# Altium schematic sheet GSM_INTERFACE.SchDoc
size A4; SheetNumber: 16; SheetTotal: 27
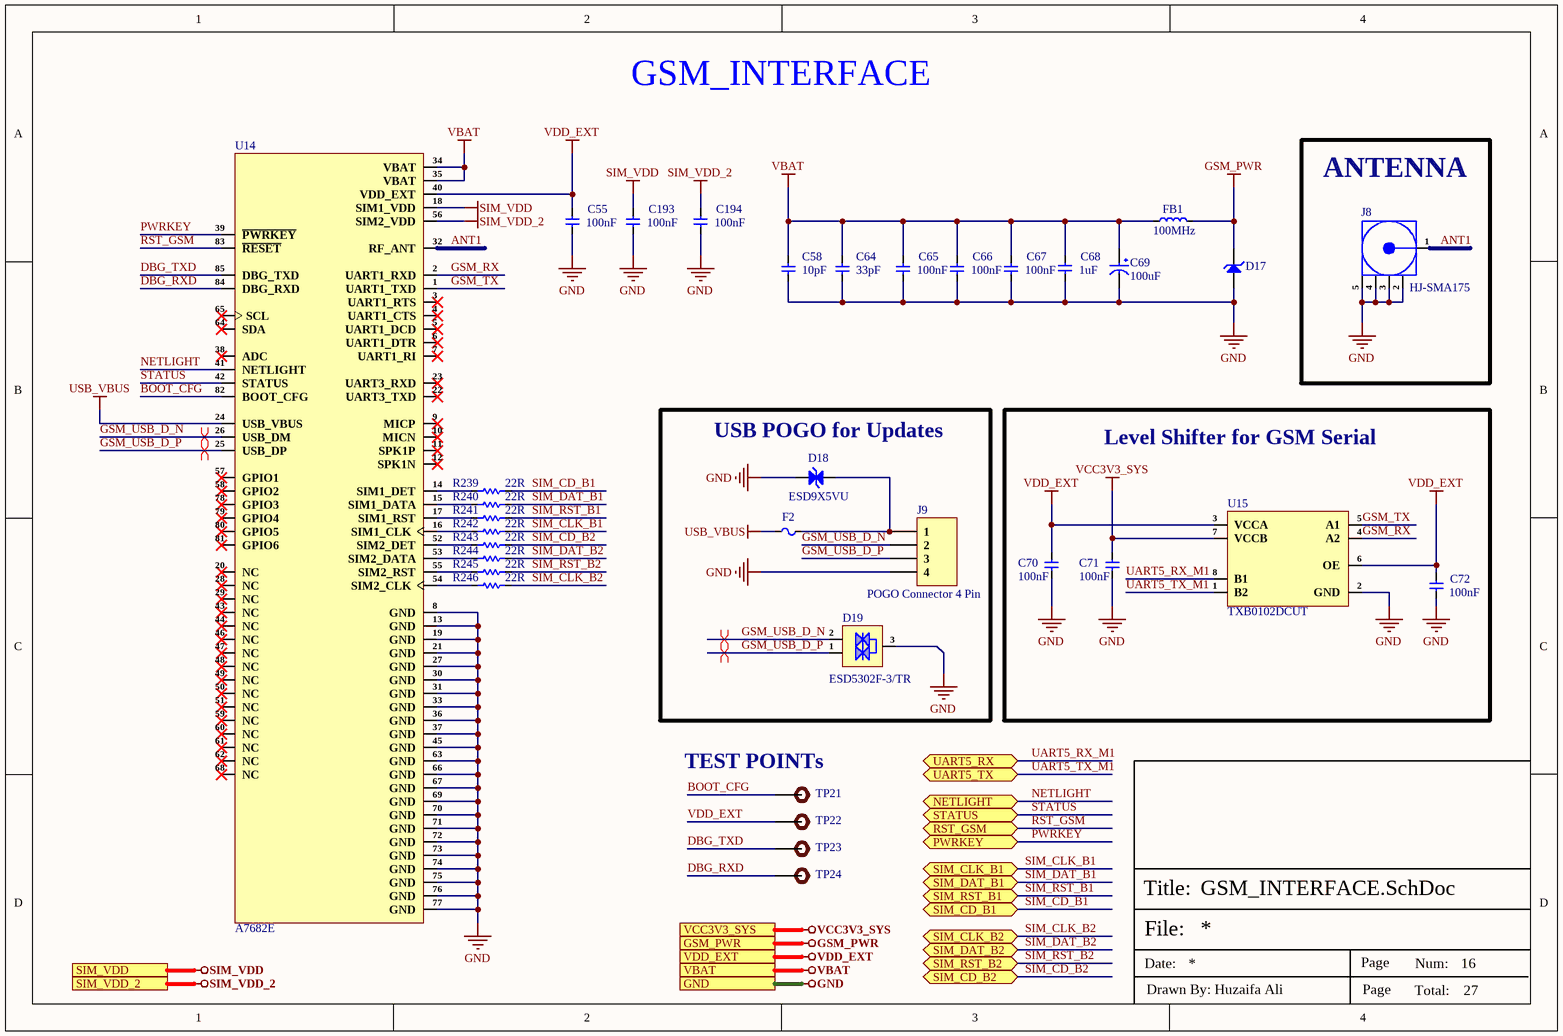
[diagram p0: GSM_INTERFACE.SchDoc]

## Parts
C55  100nF  [Cap-0402]
C58  10pF  [Cap-0402]
C64  33pF  [Cap-0402]
C65  100nF  [Cap-0402]
C66  100nF  [Cap-0402]
C67  100nF  [Cap-0402]
C68  1uF  [Cap-0402]
C69  100uF  [Case-B]
C70  100nF  [Cap-0402]
C71  100nF  [Cap-0402]
C72  100nF  [Cap-0402]
C193  100nF  [Cap-0402]
C194  100nF  [Cap-0402]
D17  MMSZ5231BT1G  [SOD-123]  (value not drawn)
D18  ESD9X5VU  [DFN1006-2L_]
D19  ESD5302F-3/TR  [Sot-23]
F2  SMD0603-050  [Fuse-0603]  (value not drawn)
FB1  100MHz  [Ind-0805]
J8  HJ-SMA175  [HJ-SMA175]
J9  POGO Connector 4 Pin  [Pogo 4 Pin]
R239  22R  [Res-0402]
R240  22R  [Res-0402]
R241  22R  [Res-0402]
R242  22R  [Res-0402]
R243  22R  [Res-0402]
R244  22R  [Res-0402]
R245  22R  [Res-0402]
R246  22R  [Res-0402]
TP21  TEST POINT 0.5mm Dia  [Test-point - 0.5mm]  (value not drawn)  (no BOM)
TP22  TEST POINT 0.5mm Dia  [Test-point - 0.5mm]  (value not drawn)  (no BOM)
TP23  TEST POINT 0.5mm Dia  [Test-point - 0.5mm]  (value not drawn)  (no BOM)
TP24  TEST POINT 0.5mm Dia  [Test-point - 0.5mm]  (value not drawn)  (no BOM)
U14  A7682E  [A7682E]
U15  TXB0102DCUT  [TXB0102DCUT]

## Blocks framed on the sheet
ANTENNA: J8
USB POGO for Updates: D18 D19 F2 J9
Level Shifter for GSM Serial: C70-C72 U15

## Ports
GND (see TOP SHEET[4B], AUDIO_INTERFACE[1D], BUCK REGULATOR[3D], DEBUG_UART_INTERFACE[3D], DIGITAL IO_RELAY_SHEET[5D], DUAL_SIM_INTERFACE[3D], ETHERNET_PHY0[4D], ETHERNET_PHY1[4D], HDMI_INTERFACE[3D], INPUT_PROTECTION[3D], LINEAR_VOLTAGE_REG[3D], MICRO_SD_INTERFACE[3D], MIPI-DSI DISPLAY[3D], POWER SECTION[3D], PUSH BUTTONs_INTERFACE[3C], RGB_LEDs_INTERFACE[3D], ROCKCHIP_PWR_SUPPLY[1D], ROCKCHIP_SYSTEM_CONTROL[3C], RS232_RS485_INTERFACE[3C], SENSOR_SHEET[3D], USB2.0_INTERFACE[3D], USB3.0_INTERFACE[3D], USB-C_INTERFACE[2D], WIEGAND_INTERFACE[3D], WIFI_BLUETOOTH_SHEET[4C]), GSM_PWR (see TOP SHEET[4A], LINEAR_VOLTAGE_REG[3D], POWER SECTION[3D]), NETLIGHT (bidir, see TOP SHEET[5B], DUAL_SIM_INTERFACE[2D]), PWRKEY (bidir, see TOP SHEET[5B], DUAL_SIM_INTERFACE[2D]), RST_GSM (bidir, see TOP SHEET[5B], DUAL_SIM_INTERFACE[2D]), SIM_CD_B1 (bidir, see TOP SHEET[5A], DUAL_SIM_INTERFACE[3D]), SIM_CD_B2 (bidir, see TOP SHEET[5A], DUAL_SIM_INTERFACE[3D]), SIM_CLK_B1 (bidir, see TOP SHEET[5A], DUAL_SIM_INTERFACE[3D]), SIM_CLK_B2 (bidir, see TOP SHEET[5A], DUAL_SIM_INTERFACE[3D]), SIM_DAT_B1 (bidir, see TOP SHEET[5A], DUAL_SIM_INTERFACE[3D]), SIM_DAT_B2 (bidir, see TOP SHEET[5A], DUAL_SIM_INTERFACE[3D]), SIM_RST_B1 (bidir, see TOP SHEET[5A], DUAL_SIM_INTERFACE[3D]), SIM_RST_B2 (bidir, see TOP SHEET[5A], DUAL_SIM_INTERFACE[3D]), SIM_VDD (see TOP SHEET[5A], DUAL_SIM_INTERFACE[3D]), SIM_VDD_2 (see TOP SHEET[5A], DUAL_SIM_INTERFACE[3D]), STATUS (bidir, see TOP SHEET[5B], DUAL_SIM_INTERFACE[2D]), UART5_RX (bidir, see TOP SHEET[5B], DEBUG_UART_INTERFACE[3D]), UART5_TX (bidir, see TOP SHEET[5B], DEBUG_UART_INTERFACE[3D]), VBAT (see TOP SHEET[5B], DUAL_SIM_INTERFACE[3D]), VCC3V3_SYS (see TOP SHEET[4A], AUDIO_INTERFACE[1D], BUCK REGULATOR[3D], DEBUG_UART_INTERFACE[3D], DIGITAL IO_RELAY_SHEET[5D], ETHERNET_PHY0[4D], ETHERNET_PHY1[4D], HDMI_INTERFACE[3D], LINEAR_VOLTAGE_REG[3D], MIPI-DSI DISPLAY[3D], POWER SECTION[3D], PUSH BUTTONs_INTERFACE[3C], ROCKCHIP_PWR_SUPPLY[1D], ROCKCHIP_SYSTEM_CONTROL[3C], RS232_RS485_INTERFACE[3C], SENSOR_SHEET[3D], USB-C_INTERFACE[2D], WIEGAND_INTERFACE[3D], WIFI_BLUETOOTH_SHEET[4C]), VDD_EXT (see TOP SHEET[5B], DUAL_SIM_INTERFACE[3D])

## Nets
GND: C55.1 C58.1 C64.1 C65.1 C66.1 C67.1 C68.2 C69.2 C70.2 C71.2 C72.1 C193.1 C194.1 D17.1(A) D18.1(A) D19.3(GND) J8.2(GND) J8.3(GND) J8.4(GND) J8.5(GND) J9.4 U14.8(GND) U14.13(GND) U14.19(GND) U14.21(GND) U14.27(GND) U14.30(GND) U14.31(GND) U14.33(GND) U14.36(GND) U14.37(GND) U14.45(GND) U14.63(GND) U14.66(GND) U14.67(GND) U14.69(GND) U14.70(GND) U14.71(GND) U14.72(GND) U14.73(GND) U14.74(GND) U14.75(GND) U14.76(GND) U14.77(GND) U15.2(GND) ; port GND
GSM_PWR: D17.2(K) FB1.2 ; port GSM_PWR
SIM_VDD: C193.2 U14.18(SIM1_VDD) ; port SIM_VDD
SIM_VDD_2: C194.2 U14.56(SIM2_VDD) ; port SIM_VDD_2
USB_VBUS: F2.1 U14.24(USB_VBUS)
VBAT: C58.2 C64.2 C65.2 C66.2 C67.2 C68.1 C69.1 FB1.1 U14.34(VBAT) U14.35(VBAT) ; port VBAT
VCC3V3_SYS: C71.1 U15.7(VCCB) ; port VCC3V3_SYS
VDD_EXT: C55.2 C70.1 C72.2 TP22.1 U14.40(VDD_EXT) U15.3(VCCA) U15.6(OE) ; port VDD_EXT
ANT1: J8.1(Signal) U14.32(RF_ANT)
BOOT_CFG: TP21.1 U14.82(BOOT_CFG)
DBG_RXD: TP24.1 U14.84(DBG_RXD)
DBG_TXD: TP23.1 U14.85(DBG_TXD)
GSM_RX: U14.2(UART1_RXD) U15.4(A2)
GSM_TX: U14.1(UART1_TXD) U15.5(A1)
GSM_USB_D_N: D19.2(I/O2) J9.2 U14.26(USB_DM)
GSM_USB_D_P: D19.1(I/O1) J9.3 U14.25(USB_DP)
NETLIGHT: U14.41(NETLIGHT) ; port NETLIGHT
PWRKEY: U14.39(~{PWRKEY}) ; port PWRKEY
RST_GSM: U14.83(~{RESET}) ; port RST_GSM
SIM_CD_B1: R239.2 ; port SIM_CD_B1
SIM_CD_B2: R243.2 ; port SIM_CD_B2
SIM_CLK_B1: R242.2 ; port SIM_CLK_B1
SIM_CLK_B2: R246.2 ; port SIM_CLK_B2
SIM_DAT_B1: R240.2 ; port SIM_DAT_B1
SIM_DAT_B2: R244.2 ; port SIM_DAT_B2
SIM_RST_B1: R241.2 ; port SIM_RST_B1
SIM_RST_B2: R245.2 ; port SIM_RST_B2
STATUS: U14.42(STATUS) ; port STATUS
UART5_RX_M1: U15.8(B1) ; port UART5_RX
UART5_TX_M1: U15.1(B2) ; port UART5_TX
NetD18_2: D18.2(A) F2.2 J9.1
NetR239_1: R239.1 U14.14(SIM1_DET)
NetR240_1: R240.1 U14.15(SIM1_DATA)
NetR241_1: R241.1 U14.17(SIM1_RST)
NetR242_1: R242.1 U14.16(SIM1_CLK)
NetR243_1: R243.1 U14.52(SIM2_DET)
NetR244_1: R244.1 U14.53(SIM2_DATA)
NetR245_1: R245.1 U14.55(SIM2_RST)
NetR246_1: R246.1 U14.54(SIM2_CLK)

Not connected (* = marked no-connect by the designer): U14 3(UART1_RTS)* 4(UART1_CTS)* 5(UART1_DCD)* 6(UART1_DTR)* 7(UART1_RI)* 9(MICP)* 10(MICN)* 11(SPK1P)* 12(SPK1N)* 20(NC)* 22(UART3_TXD)* 23(UART3_RXD)* 28(NC)* 29(NC)* 38(ADC)* 43(NC)* 44(NC)* 46(NC)* 47(NC)* 48(NC)* 49(NC)* 50(NC)* 51(NC)* 57(GPIO1)* 58(GPIO2)* 59(NC)* 60(NC)* 61(NC)* 62(NC)* 64(SDA)* 65(SCL)* 68(NC)* 78(GPIO3)* 79(GPIO4)* 80(GPIO5)* 81(GPIO6)*

## Layout directives
differential pair; net class GSM_USB; differential pair class GSM_USB_Lines; rule Impedance Constraint [Min = 88.00    Max = 90.00    ]; rule Matched Net Lengths [Tolerance = 20mil]: GSM_USB_D_N, GSM_USB_D_P

## Notes on the sheet
- GSM_INTERFACE
- (near TP21) TEST POINTs
- File:
- Title:
- Date:
- Page
- Num:
- Total:
- Drawn By: Huzaifa Ali

## Library data of the parts
C55 C65-C67 C70-C72 C193 C194 = CC0402KRX5R7BB104: CAP CER 0.1UF 16V X5R 0402; Manufacturer: Yageo; Tolerance: 10%; Supplier 1: Mouser; Manufacturer Part Number: CC0402KRX5R7BB104; RoHS: Yes; Category: Ceramic Capacitors; Stock 1: 936792; Pricing 1: 1=0.10000, 10=0.02300, 50=0.02300, 100=0.01100, 1000=0.00600, 10000=0.00400 (USD); Mount: Surface Mount; Case/Package: 0402; Case Code (Imperial): 0402; Case Code (Metric): 1005; Min Operating Temperature: -55°C; Max Operating Temperature: 85°C; Capacitance: 100nF; Packaging: Tape and Reel; Voltage Rating: 16V; Dielectric: X5R; Termination: SMD/SMT; Voltage Rating (DC): 16V; Package Quantity: 1; Length: 1mm; Width: 0.02inch; Thickness: 0.022inch; Lead Free: Lead Free; Halogen Free: Halogen Free; ComponentLink1URL: https://datasheet.ciiva.com/155/mlccorderingcode-155879.pdf?src-supplier=Digi-Key; ComponentLink1Description: https://datasheet.ciiva.com/155/mlccorderingcode-155879.pdf?src-supplier=Digi-Key; ComponentLink2URL: https://datasheet.ciiva.com/155/mlccorderingcode-155878.pdf?src-supplier=Digi-Key; ComponentLink2Description: https://datasheet.ciiva.com/155/mlccorderingcode-155878.pdf?src-supplier=Digi-Key; ComponentLink3URL: https://datasheet.ciiva.com/155/mlccorderingcode-155880.pdf?src-supplier=Digi-Key; ComponentLink3Description: https://datasheet.ciiva.com/155/mlccorderingcode-155880.pdf?src-supplier=Digi-Key; Supplier Part Number 1: 603-CC402KRX5R7BB104; LCSC Part Number: C106204; Number of Pins: 2; Resistor Type: Ceramic; Series: CC; Construction: Flat; Height: 0.5mm; Depth: 0.5mm; Radiation Hardening: No; REACH SVHC: Unknown; RoHS Compliant: Yes; ComponentLink4URL: https://datasheet.ciiva.com/11464/upy-gphc-x5r-4v-to-50v-12-11464869.pdf?src-supplier=Avnet; ComponentLink4Description: https://datasheet.ciiva.com/11464/upy-gphc-x5r-4v-to-50v-12-11464869.pdf?src-supplier=Avnet
C58 = GRM1555C1H100JA01D: CAP CER 10PF 50V C0G/NP0 0402; Manufacturer: Murata; Material: Ceramic; Dielectric: C0G; Tolerance: 5%; Item Type: Capacitor; Supplier: Arrow Electronics; Supplier Part Number: GRM1555C1H100JA01D; Manufacturer Part Number: GRM1555C1H100JA01D; RoHS: Yes; Category: Ceramic Capacitors; Stock: 3860000; Pricing: 10000=0.0034, 50000=0.0027, 100000=0.0023, 250000=0.0021 (USD); Mounting Technology: Surface Mount; Case/Package: 0402; Case Code (Metric): 1005; Case Code (Imperial): 0402; Min Operating Temperature: -55°C; Max Operating Temperature: 125°C; Value: 10pF; Voltage Rating: 50V; Packaging: Tape and Reel; Package Quantity: 1; Voltage Rating (DC): 50V; Termination: SMD/SMT; Series: GRM; Voltage: 50V; Construction: Flat; Length: 1mm; Width: 0.02inch; Height: 0.5mm; Depth: 0.5mm; Thickness: 0.022inch; Radiation Hardening: No; RoHS Compliant: Yes; Lead Free: Lead Free; Reach SVHC Compliant: No; ComponentLink1URL: https://datasheet.ciiva.com/2989/product-2989280.pdf?src-supplier=Avnet; ComponentLink1Description: https://datasheet.ciiva.com/2989/product-2989280.pdf?src-supplier=Avnet; ComponentLink2URL: https://datasheet.ciiva.com/18184/getdatasheetpartid-307234-18184164.pdf?src-supplier=Verical; ComponentLink2Description: https://datasheet.ciiva.com/18184/getdatasheetpartid-307234-18184164.pdf?src-supplier=Verical; ComponentLink3URL: https://datasheet.ciiva.com/29200/453545-da-01-en-vs-kondensator-0402-29200107.pdf?src-supplier=Conrad; ComponentLink3Description: https://datasheet.ciiva.com/29200/453545-da-01-en-vs-kondensator-0402-29200107.pdf?src-supplier=Conrad; ComponentLink4URL: https://datasheet.ciiva.com/7828/1666664-7828812.pdf?src-supplier=Element14; ComponentLink4Description: https://datasheet.ciiva.com/7828/1666664-7828812.pdf?src-supplier=Element14; ComponentLink5URL: https://datasheet.ciiva.com/6271/partnumbering-e-01-6271159.pdf?src-supplier=Digi-Key; ComponentLink5Description: https://datasheet.ciiva.com/6271/partnumbering-e-01-6271159.pdf?src-supplier=Digi-Key; ComponentLink6URL: https://datasheet.ciiva.com/6271/partnumbering-e-01-6271158.pdf?src-supplier=Digi-Key; ComponentLink6Description: https://datasheet.ciiva.com/6271/partnumbering-e-01-6271158.pdf?src-supplier=Digi-Key; ComponentLink7URL: https://datasheet.ciiva.com/6271/partnumbering-e-01-6271068.pdf?src-supplier=Digi-Key; ComponentLink7Description: https://datasheet.ciiva.com/6271/partnumbering-e-01-6271068.pdf?src-supplier=Digi-Key; LCSC Part Number: C76946
C64 = GRM1555C1E330JA01D: CAP CER 33PF 25V C0G/NP0 0402; Manufacturer: Murata; Tolerance: 5%; Dielectric: C0G; Item Type: Capacitor; Supplier 1: Digi-Key; Manufacturer Part Number: GRM1555C1E330JA01D; Stock 1: 250773; Pricing 1: 1=0.1, 10=0.034, 50=0.0184, 100=0.0151, 500=0.01078, 1000=0.00847, 2500=0.0077, 5000=0.00708 (USD); Mount: Surface Mount; Case/Package: 0402; Case Code (Metric): 1005; Case Code (Imperial): 0402; Min Operating Temperature: -55°C; Max Operating Temperature: 125°C; Capacitance: 33pF; Package Quantity: 1; Voltage Rating: 25V; Packaging: Tape and Reel; Voltage Rating (DC): 25V; Termination: SMD/SMT; Voltage: 25V; Series: GRM; Construction: Flat; Length: 1mm; Width: 0.02inch; Height: 0.5mm; Thickness: 0.022inch; Depth: 0.5mm; Radiation Hardening: No; Lead Free: Lead Free; RoHS Compliant: Yes; ComponentLink1URL: https://www.murata.com/~/media/webrenewal/support/library/catalog/products/capacitor/mlcc/c02e.ashx?la=en-us&src-supplier=Digi-Key; ComponentLink1Description: https://www.murata.com/~/media/webrenewal/support/library/catalog/products/capacitor/mlcc/c02e.ashx?la=en-us&src-supplier=Digi-Key; ComponentLink2URL: http://www.mouser.com/ds/2/281/c02e-2905.pdf?src-supplier=Mouser; ComponentLink2Description: http://www.mouser.com/ds/2/281/c02e-2905.pdf?src-supplier=Mouser; ComponentLink3URL: http://psearch.murata.com/capacitor/product/GRM1555C1E330JA01%23.pdf?src-supplier=Avnet; ComponentLink3Description: http://psearch.murata.com/capacitor/product/GRM1555C1E330JA01%23.pdf?src-supplier=Avnet; Supplier Part Number 1: 490-6177-1-ND; LCSC Part Number: C441758
C68 = CC0402KRX5R8BB105: CAP CER 1UF 25V X5R 0402; Manufacturer: Yageo; Tolerance: 10%; Supplier 1: Mouser; Manufacturer Part Number: CC0402KRX5R8BB105; RoHS: Yes; Category: Ceramic Capacitors; Stock 1: 91975; Pricing 1: 1=0.30000, 10=0.20400, 50=0.20400, 100=0.11600, 1000=0.07200, 10000=0.05900 (USD); Mount: Surface Mount; Case/Package: 0402; Case Code (Metric): 1005; Case Code (Imperial): 0402; Min Operating Temperature: -55°C; Max Operating Temperature: 85°C; Capacitance: 1uF; Dielectric: X5R; Package Quantity: 10000; Voltage Rating: 25V; Packaging: Tape and Reel; Termination: SMD/SMT; Voltage Rating (DC): 25V; Length: 0.039inch; Width: 0.02inch; Thickness: 0.022inch; Lead Free: Lead Free; Halogen Free: Halogen Free; RoHS Compliant: Yes; ComponentLink1URL: http://www.mouser.com/ds/2/447/Yageo_UPY-GP_NP0_16V-to-50V_9-358835.pdf?src-supplier=Mouser; ComponentLink1Description: http://www.mouser.com/ds/2/447/Yageo_UPY-GP_NP0_16V-to-50V_9-358835.pdf?src-supplier=Mouser; ComponentLink2URL: http://www.yageo.com/documents/recent/UPY-GPHC_X5R_4V-to-50V_25.pdf?src-supplier=Digi-Key; ComponentLink2Description: http://www.yageo.com/documents/recent/UPY-GPHC_X5R_4V-to-50V_25.pdf?src-supplier=Digi-Key; ComponentLink3URL: https://4donline.ihs.com/images/VipMasterIC/IC/YAGO/YAGO-S-A0006851646/YAGO-S-A0006851646-1.pdf?hkey=6D3A4C79FDBF58556ACFDE234799DDF0&src-supplier=Newark; ComponentLink3Description: https://4donline.ihs.com/images/VipMasterIC/IC/YAGO/YAGO-S-A0006851646/YAGO-S-A0006851646-1.pdf?hkey=6D3A4C79FDBF58556ACFDE234799DDF0&src-supplier=Newark; Supplier Part Number 1: 603-CC402KRX5R8BB105; LCSC Part Number: C326568; Weight: 2.3E-05oz
C69 = TAJB107M010RNJ: CAP TANT 100UF 20% 10V 1411; Manufacturer: Kyocera AVX; Dielectric Material: Tantalum; Tolerance: 10%; ESR (Equivalent Series Resistance): 1.4R; Leakage Current: 10uA; Dissipation Factor: 8%; Item Type: Capacitor; Supplier 1: Rs; Manufacturer Part Number: TAJB107M010RNJ; RoHS: Yes; Category: Tantalum Capacitors; Stock 1: 17520; Pricing 1: 2000=0.302 (GBP); Mounting Technology: Surface Mount; Case/Package: 1210; Case Code (Imperial): 1210; Case Code (Metric): 3528; Min Operating Temperature: -55°C; Max Operating Temperature: 125°C; Value: 100uF; Voltage Rating (DC): 10V; Series: TAJ; Construction: Flat; Voltage Rating: 10V; Package Quantity: 2000; Packaging: Tape and Reel; Termination: SMD/SMT; Voltage: 10V; Features: General Purpose; Length: 3.5mm; Width: 2.8mm; Height: 2.1mm; Depth: 2.8mm; Radiation Hardening: No; Lead Free: Lead Free; RoHS Compliant: Yes; Reach SVHC Compliant: No; ComponentLink1URL: https://datasheet.ciiva.com/264/taj-264281.pdf?src-supplier=Digi-Key; ComponentLink1Description: https://datasheet.ciiva.com/264/taj-264281.pdf?src-supplier=Digi-Key; ComponentLink2URL: https://datasheet.ciiva.com/264/taj-264280.pdf?src-supplier=Digi-Key; ComponentLink2Description: https://datasheet.ciiva.com/264/taj-264280.pdf?src-supplier=Digi-Key; ComponentLink3URL: https://datasheet.ciiva.com/264/taj-264282.pdf?src-supplier=Digi-Key; ComponentLink3Description: https://datasheet.ciiva.com/264/taj-264282.pdf?src-supplier=Digi-Key; ComponentLink4URL: https://datasheet.ciiva.com/11225/taj-11225964.pdf?src-supplier=Avnet; ComponentLink4Description: https://datasheet.ciiva.com/11225/taj-11225964.pdf?src-supplier=Avnet; ComponentLink5URL: https://datasheet.ciiva.com/11225/taj-11225963.pdf?src-supplier=Avnet; ComponentLink5Description: https://datasheet.ciiva.com/11225/taj-11225963.pdf?src-supplier=Avnet; Supplier Part Number 1: 1354069; LCSC Part Number: C7196
D17 = MMSZ5231BT1G: DIODE ZENER 5.1V 500MW SOD123; Manufacturer: ON Semiconductor; Material: Plastic; Max Reverse Leakage Current: 5uA; Impedance: 17R; Tolerance: 5%; Zener Current: 10mA; Test Current: 20mA; Forward Voltage: 900mV; Breakdown Voltage: 5.36V; Supplier 1: Allied Electronics; Manufacturer Part Number: MMSZ5231BT1G; RoHS: Yes; Category: Zener Diodes; Case/Package: SOD-123-2; Pins: 2; Min Operating Temperature: -55°C; Max Operating Temperature: 150°C; Max Power Dissipation: 500mW; Packaging: Tape and Reel; Zener Voltage: 5.1V; Package Quantity: 3000; Series: Automotive, AEC-Q101; Voltage Tolerance: 5%; Power Dissipation: 500mW; Working Voltage: 5.1V; Max Reverse Current: 5uA; Voltage Rating (DC): 5.1V; Power Rating: 500mW; Length: 2.69mm; Width: 1.6mm; Height: 1.12mm; RoHS Compliant: Yes; Lead Free: Lead Free; Reach SVHC Compliant: No; ComponentLink1URL: https://datasheet.ciiva.com/23815/1708301-23815376.pdf?src-supplier=Newark; ComponentLink1Description: https://datasheet.ciiva.com/23815/1708301-23815376.pdf?src-supplier=Newark; ComponentLink2URL: https://datasheet.ciiva.com/22626/1708301-22626967.pdf?src-supplier=Element14; ComponentLink2Description: https://datasheet.ciiva.com/22626/1708301-22626967.pdf?src-supplier=Element14; ComponentLink3URL: https://datasheet.ciiva.com/4731/mmsz5221bt1-d-4731452.pdf?src-supplier=Mouser; ComponentLink3Description: https://datasheet.ciiva.com/4731/mmsz5221bt1-d-4731452.pdf?src-supplier=Mouser; ComponentLink4URL: https://datasheet.ciiva.com/16200/mmsz5221bt1-d-16200104.pdf?src-supplier=Future+Electronics; ComponentLink4Description: https://datasheet.ciiva.com/16200/mmsz5221bt1-d-16200104.pdf?src-supplier=Future+Electronics; ComponentLink5URL: https://datasheet.ciiva.com/894/mmsz5221bt1-d-894882.pdf?src-supplier=Digi-Key; ComponentLink5Description: https://datasheet.ciiva.com/894/mmsz5221bt1-d-894882.pdf?src-supplier=Digi-Key; ComponentLink6URL: https://datasheet.ciiva.com/894/mmsz5221bt1-d-894883.pdf?src-supplier=Digi-Key; ComponentLink6Description: https://datasheet.ciiva.com/894/mmsz5221bt1-d-894883.pdf?src-supplier=Digi-Key; ComponentLink7URL: https://datasheet.ciiva.com/894/mmsz5221bt1-d-894881.pdf?src-supplier=Digi-Key; ComponentLink7Description: https://datasheet.ciiva.com/894/mmsz5221bt1-d-894881.pdf?src-supplier=Digi-Key; Supplier Part Number 1: 70099546; LCSC Part Number: C66198; Item Type: Diode
D18 = ESD9X5VU: DFN1006-2 ESD Protection Devices ROHS; Manufacturer: TECH PUBLIC; Manufacturer Part Number: ESD9X5VU; Footprint: DFN1006-2; ComponentLink1Description: LCSC; ComponentLink1URL: https://www.lcsc.com/product-detail/span-style-background-color-ff0-ESD-span-Protection-Devices_TECH-PUBLIC-ESD9X5VU_C2875160.html; LCSC Part Number: C2875160
D19 = ESD5302F-3/TR: 16A 20V 7V 5V@Max Unidirectional SOT-23 TVS ROHS; Manufacturer: WILLSEMI; Item Type: Diode; Manufacturer Part Number: ESD5302F-3/TR; Package: SOT-23; LCSC Part Number: C239643; ComponentLink1Description: LCSC; ComponentLink1URL: https://www.lcsc.com/product-detail/TVS_WILLSEMI-Will-Semicon-ESD5302F-3-TR_C239643.html
F2 = SMD0603-050: 6V 500mA 40A 1A 0603 Resettable Fuses ROHS; Manufacturer: TECHFUSE; Item Type: Fuse; Supplier 1: LCSC; Manufacturer Part Number: SMD0603-050; RoHS: No; Category: Uncategorized; Supplier Part Number 1: C69679; LCSC Part Number: C69679; ComponentLink1Description: LCSC; ComponentLink1URL: https://www.lcsc.com/product-detail/Resettable-Fuses_TECHFUSE-SMD0603-050_C69679.html
FB1 = BLM21PG300SN1D: FERRITE BEAD 30 OHM 0805 1LN; Material: Steel,Ferrite; Value: 15mR; Tolerance: 25%; Impedance: 30R; Max Current Rating: 4A; Number of Lines: 1; DC Resistance (DCR): 14mR; Max DC Current: 3A; Shielding: Unshielded; LCSC Part Number: C16903; Item Type: Ferrite Bead; ComponentLink1Description: LCSC; Supplier: Rs; Supplier Part Number: 7241536P; RoHS: Yes; Category: Ferrite Beads and Chips; Stock: 11575; Pricing: 500=0.043, 1000=0.038, 2500=0.033, 5000=0.03 (GBP); Case/Package: 0805; Pins: 2; Core Material: Ferrite; Case Code (Metric): 2012; Case Code (Imperial): 0805; Min Operating Temperature: -55°C; Max Operating Temperature: 125°C; Package Quantity: 1; Packaging: Tape and Reel; Current Rating: 4A; Termination: SMD/SMT; Test Frequency: 100MHz; DC Current: 3A; Frequency: 100MHz; Number of Circuits: 1; Series: BLM21P; DC Resistance-Max: 14mR; RMS Current (Irms): 4A; ESR: 14mR; Length: 2mm; Width: 1.25mm; Height: 0.85mm; Depth: 1.25mm; Radiation Hardening: No; Reach SVHC Compliant: No; Military Standard: Not; Lead Free: Lead Free; RoHS Compliant: Yes; ComponentLink2URL: https://datasheet.ciiva.com/19460/1845339-19460237.pdf?src-supplier=Jameco; ComponentLink2Description: https://datasheet.ciiva.com/19460/1845339-19460237.pdf?src-supplier=Jameco; ComponentLink3URL: https://datasheet.ciiva.com/11795/0900766b80021a8e-11795584.pdf?src-supplier=Rs; ComponentLink3Description: https://datasheet.ciiva.com/11795/0900766b80021a8e-11795584.pdf?src-supplier=Rs; ComponentLink4URL: https://datasheet.ciiva.com/8021/1756152-8021599.pdf?src-supplier=Element14; ComponentLink4Description: https://datasheet.ciiva.com/8021/1756152-8021599.pdf?src-supplier=Element14; ComponentLink5URL: https://datasheet.ciiva.com/6212/l0110s0100blm21p-6212358.pdf?src-supplier=Digi-Key; ComponentLink5Description: https://datasheet.ciiva.com/6212/l0110s0100blm21p-6212358.pdf?src-supplier=Digi-Key; ComponentLink6URL: https://datasheet.ciiva.com/6212/l0110s0100blm21p-6212360.pdf?src-supplier=Digi-Key; ComponentLink6Description: https://datasheet.ciiva.com/6212/l0110s0100blm21p-6212360.pdf?src-supplier=Digi-Key; ComponentLink7URL: https://datasheet.ciiva.com/3081/l0110s0100blm21p-3081657.pdf?src-supplier=Avnet; ComponentLink7Description: https://datasheet.ciiva.com/3081/l0110s0100blm21p-3081657.pdf?src-supplier=Avnet; ComponentLink8URL: https://datasheet.ciiva.com/16199/l0110s0100blm21p-16199625.pdf?src-supplier=Future+Electronics; ComponentLink8Description: https://datasheet.ciiva.com/16199/l0110s0100blm21p-16199625.pdf?src-supplier=Future+Electronics; ComponentLink9URL: https://datasheet.ciiva.com/3081/l0110s0100blm21p-3081658.pdf?src-supplier=Avnet; ComponentLink9Description: https://datasheet.ciiva.com/3081/l0110s0100blm21p-3081658.pdf?src-supplier=Avnet; ComponentLink10URL: https://datasheet.ciiva.com/41449/001172365-da-01-en-drossel-0805-30r0-2-0x1-25mm-4000st-41449606.pdf?src-supplier=Conrad; ComponentLink10Description: https://datasheet.ciiva.com/41449/001172365-da-01-en-drossel-0805-30r0-2-0x1-25mm-4000st-41449606.pdf?src-supplier=Conrad
J8 = HJ-SMA175: 1 Inner bore SMA Board Edge Bend 11mm 5.35mm Plugin RF Connectors / Coaxial Connectors ROHS; Manufacturer: HJ Tech; Item Type: SMA Connector; Manufacturer Part Number: HJ-SMA175; Package: Plugin; LCSC Part Number: C1509213; ComponentLink1Description: LCSC; ComponentLink1URL: https://www.lcsc.com/product-detail/RF-Connectors-Coaxial-Connectors_HJ-Tech-HJ-SMA175_C1509213.html
J9 = POGO Connector 4 Pin: Pogo Pad 2.5mm 4 Pin; Item Type: Pogo Connector; Manufacturer Part Number: POGO Connector 4 Pin
R239-R246 = RC0402FR-0722RL: RES 22 OHM 1% 1/16W 0402; Manufacturer: Yageo; Voltage Rating: 50V; Power Rating: 62.5mW; Temperature Coefficient: 100ppm/°C; Max Power Dissipation: 63mW; Item Type: Resistor; Supplier 1: Avnet; Manufacturer Part Number: RC0402FR-0722RL; RoHS: Yes; Category: Chip SMD Resistors; Stock 1: 1810000; Pricing 1: 10000=0.00085 (USD); Case/Package: 0402; Number of Pins: 2; Case Code (Imperial): 0402; Case Code (Metric): 1005; Size Code: 0402; Min Operating Temperature: -55°C; Max Operating Temperature: 155°C; Resistor Type: Thick Film; Voltage Rating (DC): 50V; Resistance: 22R; Tolerance: 1%; Packaging: Tape and Reel; Termination: SMD/SMT; Features: Moisture Resistant; Series: RC; Number of Terminations: 2; Resistance Tolerance: 1%; Technology: THICK FILM; Construction: Rectangular; Length: 1mm; Width: 0.5mm; Height: 0.32mm; Depth: 0.5mm; RoHS Compliant: Yes; Reach SVHC Compliant: Yes; Military Standard: Not; Lead Free: Lead Free; ComponentLink1URL: https://datasheet.ciiva.com/11819/0900766b80c66297-11819462.pdf?src-supplier=RSComponents; ComponentLink1Description: https://datasheet.ciiva.com/11819/0900766b80c66297-11819462.pdf?src-supplier=RSComponents; ComponentLink2URL: https://datasheet.ciiva.com/7849/1018594-7849912.pdf?src-supplier=Element14; ComponentLink2Description: https://datasheet.ciiva.com/7849/1018594-7849912.pdf?src-supplier=Element14; ComponentLink3URL: https://datasheet.ciiva.com/7849/1018594-7849911.pdf?src-supplier=Element14; ComponentLink3Description: https://datasheet.ciiva.com/7849/1018594-7849911.pdf?src-supplier=Element14; ComponentLink4URL: https://datasheet.ciiva.com/16930/pyu-rc0402-51-rohs-l-6-r-16930687.pdf?src-supplier=Future+Electronics; ComponentLink4Description: https://datasheet.ciiva.com/16930/pyu-rc0402-51-rohs-l-6-r-16930687.pdf?src-supplier=Future+Electronics; ComponentLink5URL: https://datasheet.ciiva.com/26829/getdatasheetpartid-554995-26829991.pdf?src-supplier=Verical; ComponentLink5Description: https://datasheet.ciiva.com/26829/getdatasheetpartid-554995-26829991.pdf?src-supplier=Verical; Supplier Part Number 1: RC0402FR-0722RL; LCSC Part Number: C114765
TP21-TP24 = TEST POINT 0.5mm Dia: Test Point ON; Item Type: Test Point; Manufacturer Part Number: TEST POINT 0.5mm Dia
U14 = A7682E: LGA-85_19.6x19.6x1.10P RF Modules ROHS; Manufacturer: SIMCom Wireless Solutions; Item Type: Module; Manufacturer Part Number: A7682E; Package: LGA-85_19.6x19.6x1.10P; LCSC Part Number: C5362858; ComponentLink1Description: LCSC; ComponentLink1URL: https://www.lcsc.com/product-detail/RF-Modules_SIMCom-Wireless-Solutions-A7682E_C5362858.html
U15 = TXB0102DCUT: IC TRNSLTR BIDIRECTIONAL US8; Manufacturer: Texas Instruments; Propagation Delay: 31ns; Min Supply Voltage: 1.65V; Max Supply Voltage: 5.5V; Data Rate: 100Mbps; Number of Channels: 2; Logic Function: Translator; Turn-On Delay Time: 7.4ns; High Level Output Current: -20uA; Low Level Output Current: 20uA; Output Type: 3-STATE; Output Current: 50mA; Supplier 1: Arrow Electronics; Manufacturer Part Number: TXB0102DCUT; RoHS: Yes; Category: Integrated Circuits (ICs); Stock 1: 10; Pricing 1: 1=0.79330, 10=0.66470, 25=0.65820, 250=0.37450, 500=0.36200, 1000=0.29770, 2500=0.28440 (USD); Mount: Surface Mount; Case/Package: VSSOP; Number of Pins: 8; Weight: 0.000339oz; Contact Plating: Gold; Min Operating Temperature: -40°C; Max Operating Temperature: 85°C; Packaging: Tape and Reel; Package Quantity: 1; Number of Bits: 2; Series: -; Number of Inputs: 2; Length: 2.3mm; Width: 2mm; Height: 0.85mm; Radiation Hardening: No; Lead Free: Lead Free; RoHS Compliant: Yes; REACH SVHC: No SVHC; ComponentLink1URL: https://datasheet.ciiva.com/4226/sces641b-4226901.pdf?src-supplier=Arrow+Electronics; ComponentLink1Description: https://datasheet.ciiva.com/4226/sces641b-4226901.pdf?src-supplier=Arrow+Electronics; ComponentLink2URL: https://datasheet.ciiva.com/15096/getdatasheetpartid-226009-15096242.pdf?src-supplier=Verical; ComponentLink2Description: https://datasheet.ciiva.com/15096/getdatasheetpartid-226009-15096242.pdf?src-supplier=Verical; ComponentLink3URL: https://datasheet.ciiva.com/14287/txb0102-14287498.pdf?src-supplier=Avnet; ComponentLink3Description: https://datasheet.ciiva.com/14287/txb0102-14287498.pdf?src-supplier=Avnet; ComponentLink4URL: https://datasheet.ciiva.com/14287/txb0102-14287370.pdf?src-supplier=Avnet; ComponentLink4Description: https://datasheet.ciiva.com/14287/txb0102-14287370.pdf?src-supplier=Avnet; ComponentLink5URL: https://datasheet.ciiva.com/6619/txb0102-6619255.pdf?src-supplier=Digi-Key; ComponentLink5Description: https://datasheet.ciiva.com/6619/txb0102-6619255.pdf?src-supplier=Digi-Key; ComponentLink6URL: https://datasheet.ciiva.com/6619/txb0102-6619256.pdf?src-supplier=Digi-Key; ComponentLink6Description: https://datasheet.ciiva.com/6619/txb0102-6619256.pdf?src-supplier=Digi-Key; ComponentLink7URL: https://datasheet.ciiva.com/6619/txb0102-6619257.pdf?src-supplier=Digi-Key; ComponentLink7Description: https://datasheet.ciiva.com/6619/txb0102-6619257.pdf?src-supplier=Digi-Key; Supplier Part Number 1: TXB0102DCUT